# Altium schematic sheet Amplifier & Output.SchDoc
size A3; CheckedBy: Alain.Zhu; CompanyName: TYMPHANY; DrawnBy: Yetta.He; Organization: PABU-BL3; Address1: 11F,block A, CEC building,; Address2: No.2070 Shennan Zhong road,; Address3: Huaqiang North, Futian District,; Address4: Shenzhen,  Guang Dong, P.R.C 518000; DocumentNumber: 7; Revision: 1.0.0; SheetNumber: 7; SheetTotal: 8; Size: A3; PCB By: Yetta.He; Status: DP1.1
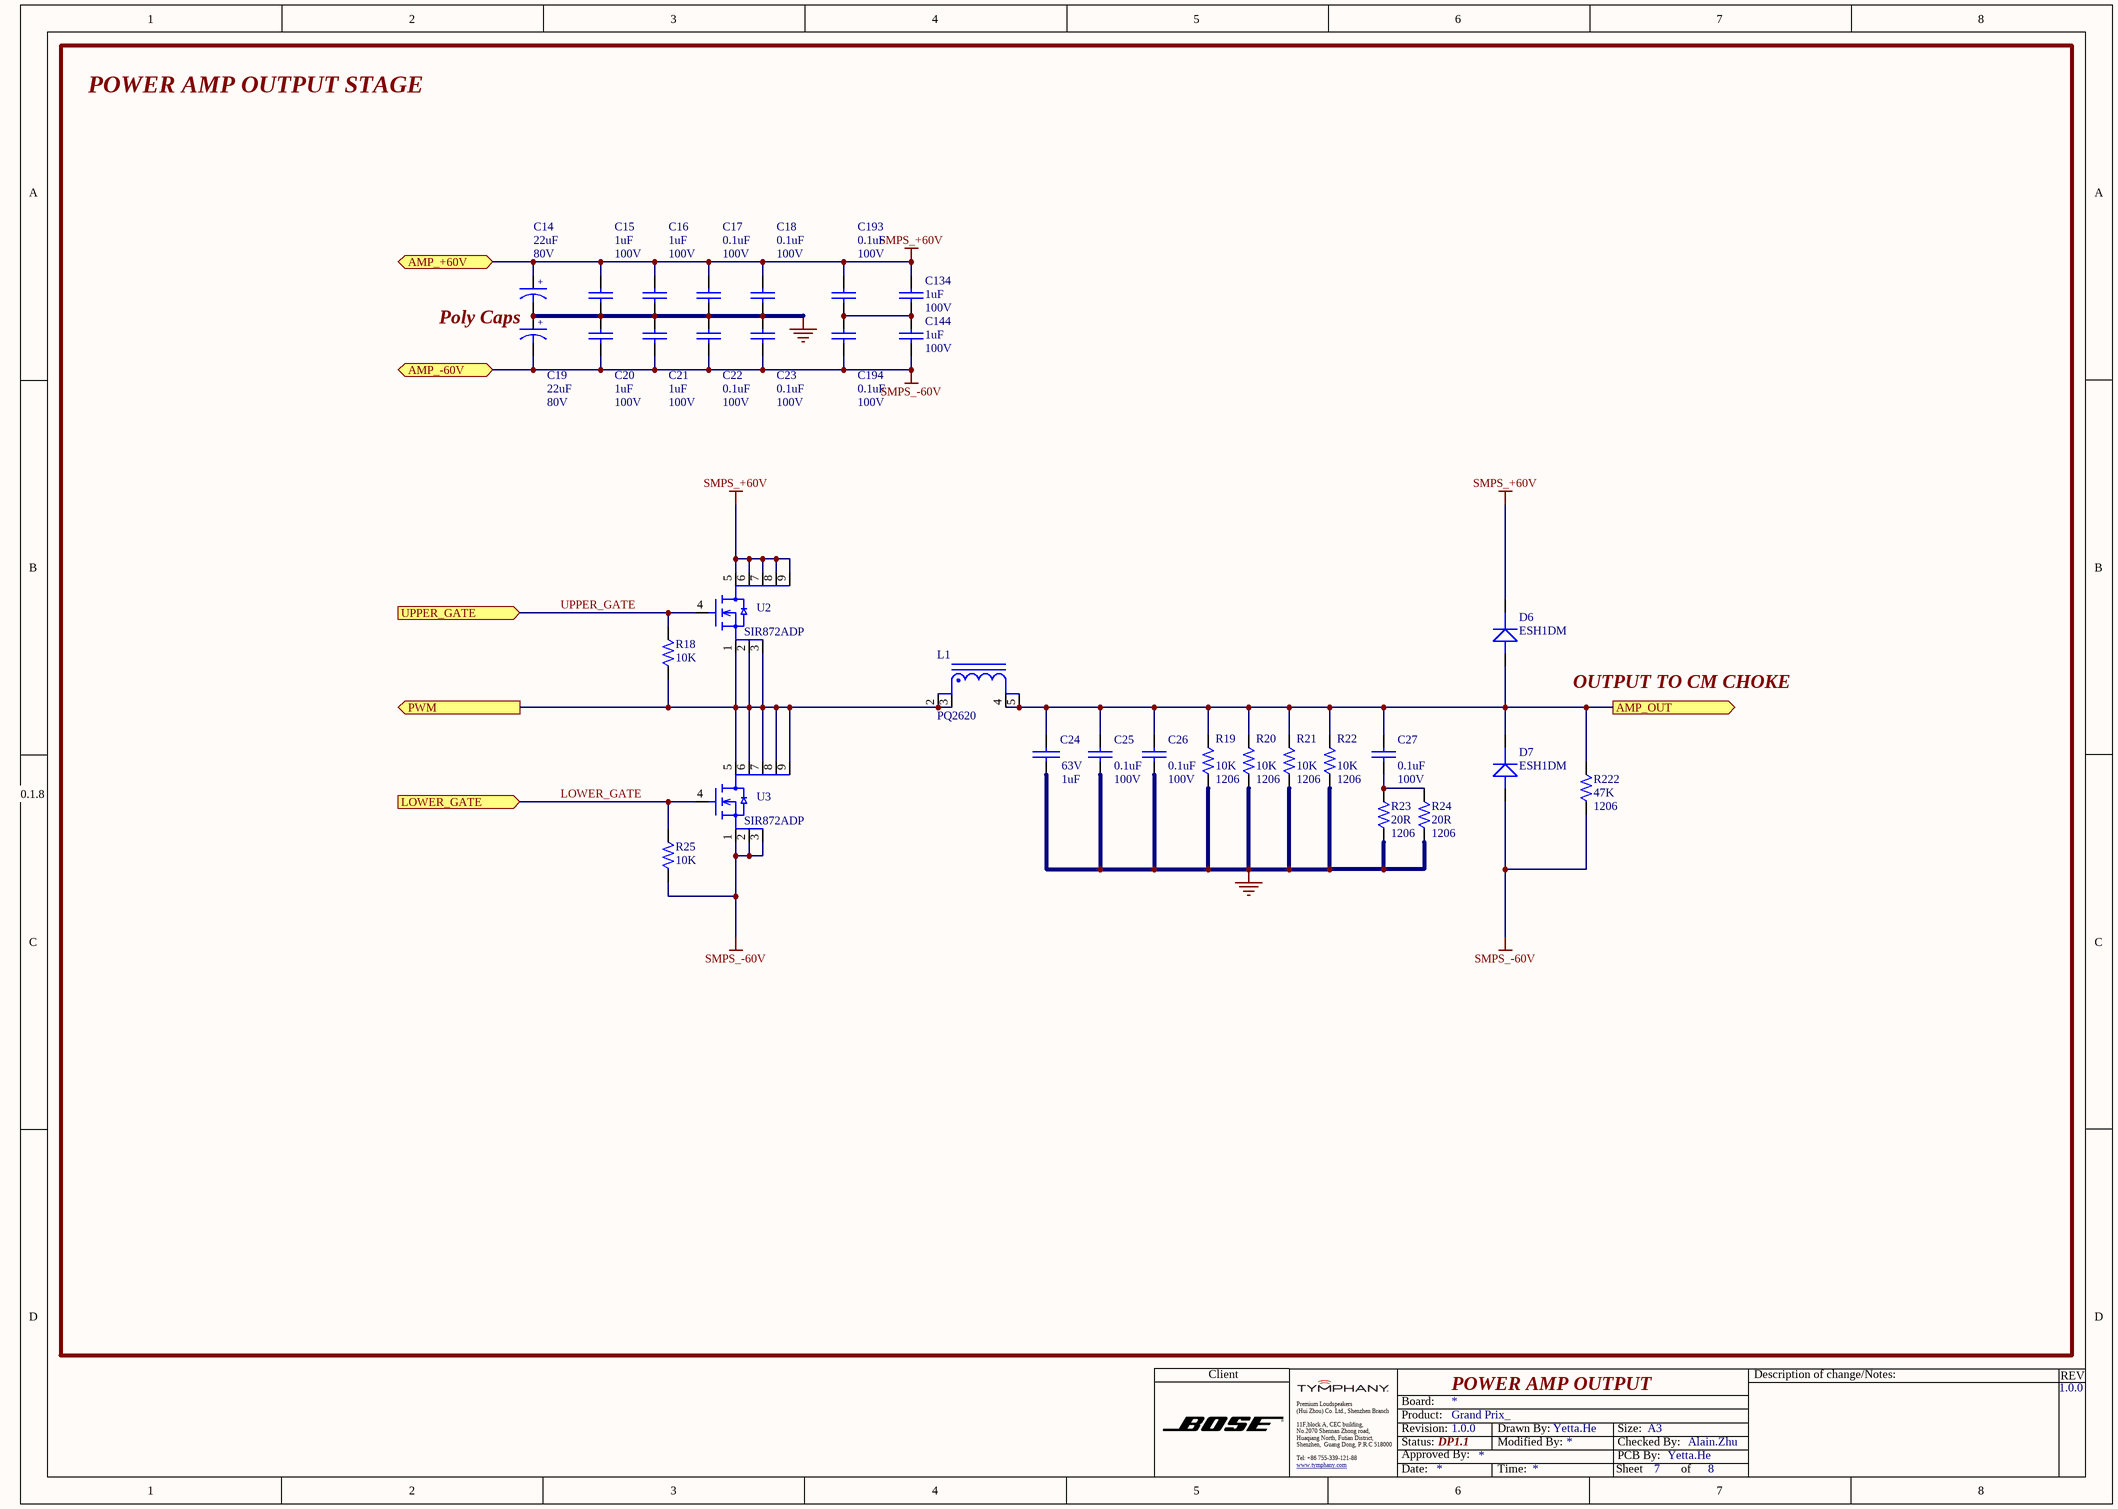
[diagram p0: Amplifier & Output.SchDoc]

## Parts
C14  value 22uF  Voltage: 80V  [CASE - F]  (hidden comment: CAP E 22uF 80V 20% SMD_HBV220M1KTR-0810)
C15  value 1uF  Voltage: 100V  [CAPC0805X125N-RW]  (hidden comment: T54000000644C)
C16  value 1uF  Voltage: 100V  [CAPC0805X125N-RW]  (hidden comment: T54000000644C)
C17  value 0.1uF  Voltage: 100V  [CAPC0603-RW]  (hidden comment: T542021047605)
C18  value 0.1uF  Voltage: 100V  [CAPC0603-RW]  (hidden comment: T542021047605)
C19  value 22uF  Voltage: 80V  [CASE - F]  (hidden comment: CAP E 22uF 80V 20% SMD_HBV220M1KTR-0810)
C20  value 1uF  Voltage: 100V  [CAPC0805X125N-RW]  (hidden comment: T54000000644C)
C21  value 1uF  Voltage: 100V  [CAPC0805X125N-RW]  (hidden comment: T54000000644C)
C22  value 0.1uF  Voltage: 100V  [CAPC0603-RW]  (hidden comment: T542021047605)
C23  value 0.1uF  Voltage: 100V  [CAPC0603-RW]  (hidden comment: T542021047605)
C24  value 1uF  Voltage: 63V  [1uF 63V TDK MKP]  (hidden comment: CAP E MKP 1uF 63V 5%)
C25  value 0.1uF  Voltage: 100V  [CAPC0603-RW]  (hidden comment: T542021047605)
C26  value 0.1uF  Voltage: 100V  [CAPC0603-RW]  (hidden comment: T542021047605)
C27  value 0.1uF  Voltage: 100V  [CAPC0603-RW]  (hidden comment: T542021047605)
C134  value 1uF  Voltage: 100V  [CAPC0805X125N-RW]  (hidden comment: T54000000644C)
C144  value 1uF  Voltage: 100V  [CAPC0805X125N-RW]  (hidden comment: T54000000644C)
C193  value 0.1uF  Voltage: 100V  [CAPC0603-RW]  (hidden comment: T542021047605)
C194  value 0.1uF  Voltage: 100V  [CAPC0603-RW]  (hidden comment: T542021047605)
D6  T571002680204  [Micro SMA]  (value not drawn)
D7  T571002680204  [Micro SMA]  (value not drawn)
L1  PQ2620  [PQ2620]
R18  value 10K  [0603-RW]  (hidden comment: QCF011030-1002)
R19  value 10K  PACKAGE: 1206  [1206-RW]  (hidden comment: QCF041010-1002)
R20  value 10K  PACKAGE: 1206  [1206-RW]  (hidden comment: QCF041010-1002)
R21  value 10K  PACKAGE: 1206  [1206-RW]  (hidden comment: QCF041010-1002)
R22  value 10K  PACKAGE: 1206  [1206-RW]  (hidden comment: QCF041010-1002)
R23  value 20R  PACKAGE: 1206  [1206-RW]  (hidden comment: QCF041011-2009)
R24  value 20R  PACKAGE: 1206  [1206-RW]  (hidden comment: QCF041011-2009)
R25  value 10K  [0603-RW]  (hidden comment: QCF011030-1002)
R222  value 47K  PACKAGE: 1206  [1206-RW]  (hidden comment: QCF041010-4702)
U2  RCM000872-1001  [DFN8(5X6)]  (value not drawn)
U3  RCM000872-1001  [DFN8(5X6)]  (value not drawn)

## Ports
AMP_+60V (bidir), AMP_-60V (bidir), AMP_OUT (out), LOWER_GATE (in), PWM (out), UPPER_GATE (in)

## Nets
GND: C14.2 C15.2 C16.2 C17.2 C18.2 C19.1 C20.1 C21.1 C22.1 C23.1 C24.2 C25.2 C26.2 R19.1 R20.1 R21.1 R22.1 R23.1 R24.1
SMPS_+60V: C14.1 C15.1 C16.1 C17.1 C18.1 C134.1 C193.1 D6.2(K) U2.5(D) U2.6(D) U2.7(D) U2.8(D) U2.9(D) ; port AMP_+60V
SMPS_-60V: C19.2 C20.2 C21.2 C22.2 C23.2 C144.2 C194.2 D7.1(A) R25.1 R222.1 U3.1(S) U3.2(S) U3.3(S) ; port AMP_-60V
AMP_OUT: C24.1 C25.1 C26.1 C27.1 D6.1(A) D7.2(K) L1.4 L1.5 R19.2 R20.2 R21.2 R22.2 R222.2 ; port AMP_OUT
LOWER_GATE: R25.2 U3.4(G) ; port LOWER_GATE
PWM: L1.2 L1.3 R18.1 U2.1(S) U2.2(S) U2.3(S) U3.5(D) U3.6(D) U3.7(D) U3.8(D) U3.9(D) ; port PWM
UPPER_GATE: R18.2 U2.4(G) ; port UPPER_GATE
NetC27_2: C27.2 R23.2 R24.2
NetC134_2: C134.2 C144.1 C193.2 C194.1

## Notes on the sheet
- POWER AMP OUTPUT STAGE
- Poly Caps
- OUTPUT TO CM CHOKE
- 0.1.8
- POWER AMP OUTPUT
- Client
- Description of change/Notes:
- REV
- Premium Loudspeakers
- (Hui Zhou) Co. Ltd., Shenzhen Branch
- Tel: +86 755-339-121-88
- Board:
- Status:
- Revision:
- Product:
- Approved By:
- Grand Prix_
- Drawn By:
- Modified By:
- Checked By:
- PCB By:
- Size:
- www.tymphany.com <http://www.tymphany.com>
- Date:
- Time:
- Sheet
- of
- (in symbol CAP E 22uF 80V 20% SMD_HBV220M1KTR-0810) +

## Library data of the parts
C14 C19 = CAP E 22uF 80V 20% SMD_HBV220M1KTR-0810: E 22UF 80V +-20% 8*10 HBV220M1KTR-0810; SAP: T5512204C5010; Type: Capacitor; DIP&SMD: SMD; CREATE NAME: Cherry; PACKAGE: CASE - F; Vendor Name: *; Vendor Code: *; MFG: *; MFG Part: HBV220M1KTR-0810; Other: *; Tolerance: 20%; Customer Specific: N/A; CREATE TIME: 2019-04-01
C15 C16 C20 C21 C134 C144 = CAPC0805 1uF 100V 10%_X7S_TDK: CAP 1.0UF 100V +-10% 0805X7S TDK L; Other: X7S; Tolerance: 10%; Type: Capacitor; CREATE_NAME: Nathan; DIP&SMD: SMD; SAP: T54000000644C; PACKAGE: CAPC0805; Vendor Code: *; Vendor Name: *; MFG: TDK; MFG Part: *; CREATE_TIME: 06-Aug-2016; Customer Specific: N/A
C17 C18 C22 C23 C25-C27 C193 C194 = CAP0603 0.1uF 100V 10%_X7R_MURATA: CAP X7R .10UF 100V +-10% 0603 MURATA L; Tolerance: 10%; Type: Capacitor; CREATE_NAME: Nathan; DIP&SMD: SMD; SAP: T542021047605; PACKAGE: CAPC0603; MFG: MURATA; MFG Part: *; Other: X7R; CREATE_TIME: 02-Aug-2016; Customer Specific: N/A; Vendor Name: *
C24 = CAP E MKP 1uF 63V 5%: PLS-DIP 1UF 63V +-5% T B32529C0 K; SAP: T564105208020; MFG: TDK; CREATE_NAME: Yetta; Type: Capacitor; DIP&SMD: DIP; PACKAGE: 1uF/63V; Vendor Name: *; Vendor Code: *; MFG Part: B32529C0; Other: *; Tolerance: 5%; CREATE_TIME: 23-NOV-2018; Customer Specific: N/A
D6 D7 = ESH1DM: DIODE 200V 1.0A ESH1DM TSC G; Current: 1A; CREATE_NAME: Tom; DIP&SMD: SMD; MFG: TSC; SAP: T571002680204; Vendor Name: *; Vendor Code: *; Voltage: 200V; Type: DIODE; CREATE_TIME: 19-Jul-2016; Package: Micro SMA; Customer Specific: N/A; MFG Part: ESH1DM
L1 = PQ2620: INDUCTOR 11uH; MFG: Gloria; Tolerance: 10%; DIP&SMD: DIP; Value: 11uH; Current: *; Type: INDUCTOR; MFG Part: PQ2620
R18 R25 = RES0603 1/10W 1% 10K OHM: GP CHIP RES. 10K OHM 1/10W 1% 0603; Vendor Code: 10010262; SAP: T502100202399; Vendor Name: 东莞市晴远电子有限公司; DIP&SMD: SMD; Power: 1/10W; MFG Part: *; MFG: *; TOL: 1%; Type: Resistor; PACKAGE: 0603; Customer Specific: N/A
R19-R22 = RES1206 1/4W 1% 10K OHM: GP CHIP RES. 10K OHM 1/4  W 1% TF 1206; Vendor Code: 10010262; SAP: T502100204399; Power: 1/4W; Vendor Name: 东莞市晴远电子有限公司; DIP&SMD: SMD; MFG Part: *; MFG: *; TOL: 1%; Type: Resistor; Customer Specific: N/A
R23 R24 = RES1206 1/4W 1% 20 OHM: CHIP 20 OHM 100PPM +-1% 1206 WALS L; Vendor Code: 10010262; SAP: T502200A04399; Power: 1/4W; Vendor Name: 东莞市晴远电子有限公司; MFG: WALSIN (華新); TOL: 1%; DIP&SMD: SMD; MFG Part: *; Type: Resistor; Customer Specific: N/A
R222 = RES1206 1/4W 1% 47K OHM: CHIP RES. 47K OHM 1206 1%; Vendor Code: 10010262; SAP: T502470204399; Power: 1/4W; Vendor Name: 东莞市晴远电子有限公司; DIP&SMD: SMD; MFG Part: *; MFG: *; TOL: 1%; Type: Resistor; Customer Specific: N/A
U2 U3 = SIR872ADP: N-Channel  MOSFET SO-8 SiR872ADP 150V(D-S); MFG: VISHAY; SAP: T586002791835; CREATE_NAME: Nathan; Current: 53.7A; Power: 104W; Vendor Code: *; Vendor Name: *; Type: N-Channel MOSFET; CREATE_TIME: 21-Nov-2014; Voltage: 150V; Package: DFN8(5X6); MFG Part: SIR872ADP